# Altium schematic sheet XP-Hardv_PMU.SchDoc
size A4
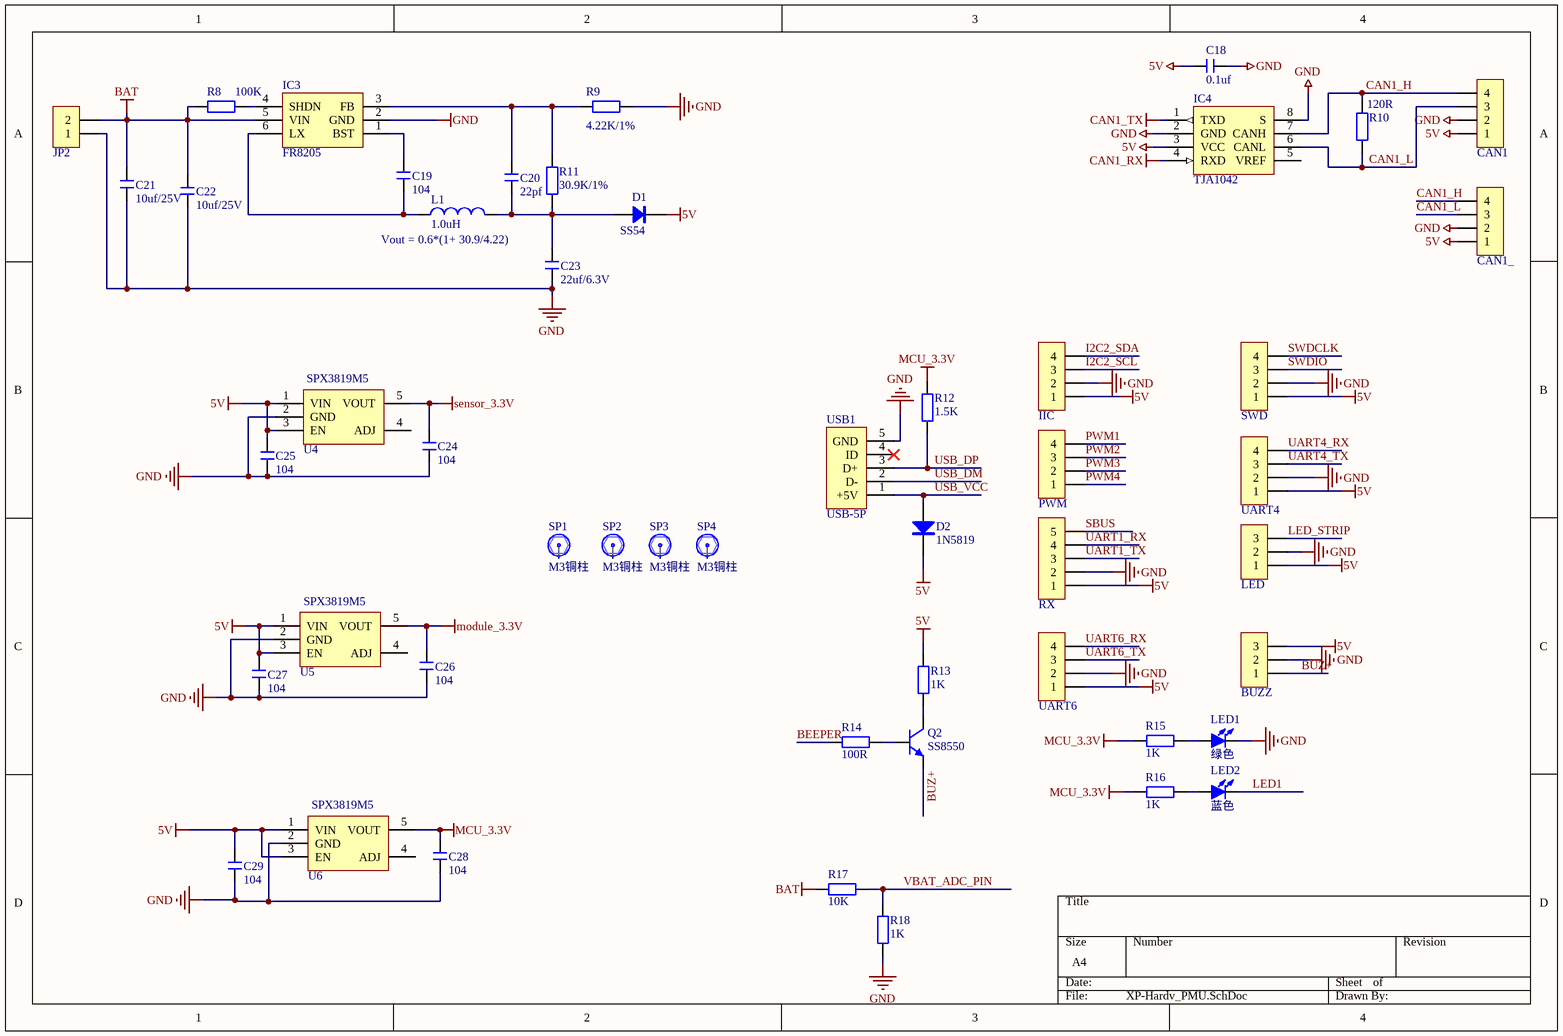
[diagram p0: XP-Hardv_PMU.SchDoc]

## Parts
BUZZ  Header 3  [SH1.00-WS-3P]  (value not drawn)
C18  0.1uf  [0402-C-1.6*0.5]
C19  104  [C 0402_M]
C20  22pf  [C 0402_M]
C21  10uf/25V  [C 0603_L]
C22  10uf/25V  [C 0603_L]
C23  22uf/6.3V  [C 0603_L]
C24  104  [C 0402_M]
C25  104  [C 0402_M]
C26  104  [C 0402_M]
C27  104  [C 0402_M]
C28  104  [C 0402_M]
C29  104  [C 0402_M]
CAN1  Header 4  [SH1.00-WS-4P]  (value not drawn)
CAN1_  Header 4  [SH1.00-WS-4P]  (value not drawn)
D1  SS54  [SMA]
D2  1N5819  [SOD-323]
IC3  FR8205  [SOT23-6L]
IC4  TJA1042  [L - HVSON - 8 - 3*3]
IIC  Header 4  [SH1.00-WS-4P]  (value not drawn)
JP2  HDR-1X2  [HDR2.54-LI-2P]  (value not drawn)
L1  1.0uH  [L - 7X7-F]
LED  Header 3  [SH1.00-WS-3P]  (value not drawn)
LED1  绿色  [LED 0603G]
LED2  蓝色  [LED 0603B]
PWM  Header 4  [SH1.00-WS-4P]  (value not drawn)
Q2  SS8550  [SOT23-3M]
R8  100K  [R 0402_M]
R9  4.22K/1%  [R 0402_M]
R10  120R  [0402-R-1.6*0.5]
R11  30.9K/1%  [R 0402_M]
R12  1.5K  [R 0402_M]
R13  1K  [R 0402_M]
R14  100R  [R 0402_M]
R15  1K  [R 0402_M]
R16  1K  [R 0402_M]
R17  10K  [R 0402_M]
R18  1K  [R 0402_M]
RX  Header 5  [SH1.00-WS-5P]  (value not drawn)
SP1  M3铜柱  [M3x4+6_L]
SP2  M3铜柱  [M3x4+6_L]
SP3  M3铜柱  [M3x4+6_L]
SP4  M3铜柱  [M3x4+6_L]
SWD  Header 4  [SH1.00-WS-4P]  (value not drawn)
U4  SPX3819M5  [L - SOT23-5L]
U5  SPX3819M5  [L - SOT23-5L]
U6  SPX3819M5  [L - SOT23-5L]
UART4  Header 4  [SH1.00-WS-4P]  (value not drawn)
UART6  Header 4  [SH1.00-WS-4P]  (value not drawn)
USB1  USB-5P  [USB-MICRO_D]

## Nets
5V: BUZZ.3 C18.1 C25.2 C27.2 C29.2 CAN1.1 CAN1_.1 D1.2(K) D2.2(K) IC4.3(VCC) IIC.1 LED.1 R13.2 RX.1 SWD.1 U4.1(VIN) U4.3(EN) U5.1(VIN) U5.3(EN) U6.1(VIN) U6.3(EN) UART4.1 UART6.1
BAT: C21.2 C22.2 IC3.5(VIN) JP2.2 R8.1 R17.1
CAN1_RX: IC4.4(RXD)
CAN1_TX: IC4.1(TXD)
GND: BUZZ.2 C18.2 C21.1 C22.1 C23.1 C24.1 C25.1 C26.1 C27.1 C28.1 C29.1 CAN1.2 CAN1_.2 IC3.2(GND) IC4.2(GND) IC4.8(S) IIC.2 JP2.1 LED.2 LED1.2(K) R9.2 R18.1 RX.2 SWD.2 U4.2(GND) U5.2(GND) U6.2(GND) UART4.2 UART6.2 USB1.5(GND)
MCU_3.3V: C28.2 R12.2 R15.2 R16.2 U6.5(VOUT)
module_3.3V: C26.2 U5.5(VOUT)
sensor_3.3V: C24.2 U4.5(VOUT)
BEEPER: R14.1
BUZ+: BUZZ.1 Q2.2(E)
CAN1_H: CAN1.4 CAN1_.4 IC4.7(CANH) R10.1
CAN1_L: CAN1.3 CAN1_.3 IC4.6(CANL) R10.2
I2C2_SCL: IIC.3
I2C2_SDA: IIC.4
LED1: LED2.2(K)
LED_STRIP: LED.3
PWM1: PWM.4
PWM2: PWM.3
PWM3: PWM.2
PWM4: PWM.1
SBUS: RX.5
SWDCLK: SWD.4
SWDIO: SWD.3
UART1_RX: RX.4
UART1_TX: RX.3
UART4_RX: UART4.4
UART4_TX: UART4.3
UART6_RX: UART6.4
UART6_TX: UART6.3
USB_DM: USB1.2(D-)
USB_DP: R12.1 USB1.3(D+)
USB_VCC: D2.1(A) USB1.1(+5V)
VBAT_ADC_PIN: R17.2 R18.2
NetC19_1: C19.1 IC3.6(LX) L1.1
NetC19_2: C19.2 IC3.1(BST)
NetC20_1: C20.1 IC3.3(FB) R9.1 R11.2
NetC20_2: C20.2 C23.2 D1.1(A) L1.2 R11.1
NetIC3_4: IC3.4(SHDN) R8.2
NetLED1_1: LED1.1(A) R15.1
NetLED2_1: LED2.1(A) R16.1
NetQ2_1: Q2.1(B) R14.2
NetQ2_3: Q2.3(C) R13.1

Not connected (* = marked no-connect by the designer): IC4 5(VREF); SP1 1; SP2 1; SP3 1; SP4 1; U4 4(ADJ); U5 4(ADJ); U6 4(ADJ); USB1 4(ID)*

## Notes on the sheet
- Vout = 0.6*(1+ 30.9/4.22)

## Library data of the parts
BUZZ LED = Header 3: 3P接插件; 版权所有: 河池学院智能控制重点实验室; 了解我们: http://www.jianshengdrlab.com; Library name: 3P接插件
C18 = C
C19-C23 = C: 无极性贴片电容; 版权归属: 源创客; 材质: X7R; BOM名称: 无极性贴片电容; 学习资源: www.ooocke.com
C24-C29 = C: 无极性贴片电容; 版权归属: 源创客; BOM名称: 无极性贴片电容; 学习资源: www.ooocke.com
CAN1 CAN1_ IIC PWM SWD UART4 UART6 = Header 4: 4P接插件; 版权所有: 河池学院智能控制重点实验室; 了解我们: http://www.jianshengdrlab.com; Library name: 4P接插件
D1 = SS54: 肖特基二极管; 版权归属: 源创客; 属性: 40V/3A; BOM名称: 肖特基二极管; 学习资源: www.ooocke.com
D2 = 1N5819: 肖特基二极管; 版权归属: 源创客; 属性: 40V/2A; BOM名称: 肖特基二极管; 学习资源: www.ooocke.com
IC3 = SX1308: 可调升压芯片; 版权归属: 源创客; BOM名称: 可调升压芯片; 学习资源: www.ooocke.com
IC4 = TJA1050: CAN总线收发芯片; 版权归属: 源创客; BOM名称: CAN总线收发芯片; 学习资源: www.ooocke.com
JP2 = Header 2: 2P接插件; 版权归属: 源创客; BOM名称: 2P接插件; 学习资源: www.ooocke.com
L1 = L
LED1 LED2 = LED-SMD: 贴片LED; 版权归属: 源创客; BOM名称: 贴片LED; 学习资源: www.ooocke.com
Q2 = 8050-SMD: 高频放大-NPN型; 版权归属: 源创客; 属性: 40V 1.5A 1W 100MHZ; BOM名称: 高频放大-NPN型; 学习资源: www.ooocke.com
R8 R9 R11-R18 = R: 贴片电阻; 版权归属: 源创客; BOM名称: 贴片电阻; 学习资源: www.ooocke.com
R10 = R
RX = Header 5: 5P接插件; 版权所有: 河池学院智能控制重点实验室; 了解我们: http://www.jianshengdrlab.com; Library name: 5P接插件
SP1-SP4 = 铜柱加头小焊盘: 铜柱; 版权归属: 源创客; BOM名称: 铜柱; 学习资源: www.ooocke.com
U4-U6 = SPX3819M5: 元件名称: SPX3819M5稳压器; 版权所有: Ly
USB1 = USB-5P: 微型USB母座; 版权归属: 源创客; BOM名称: 微型USB母座; 学习资源: www.ooocke.com